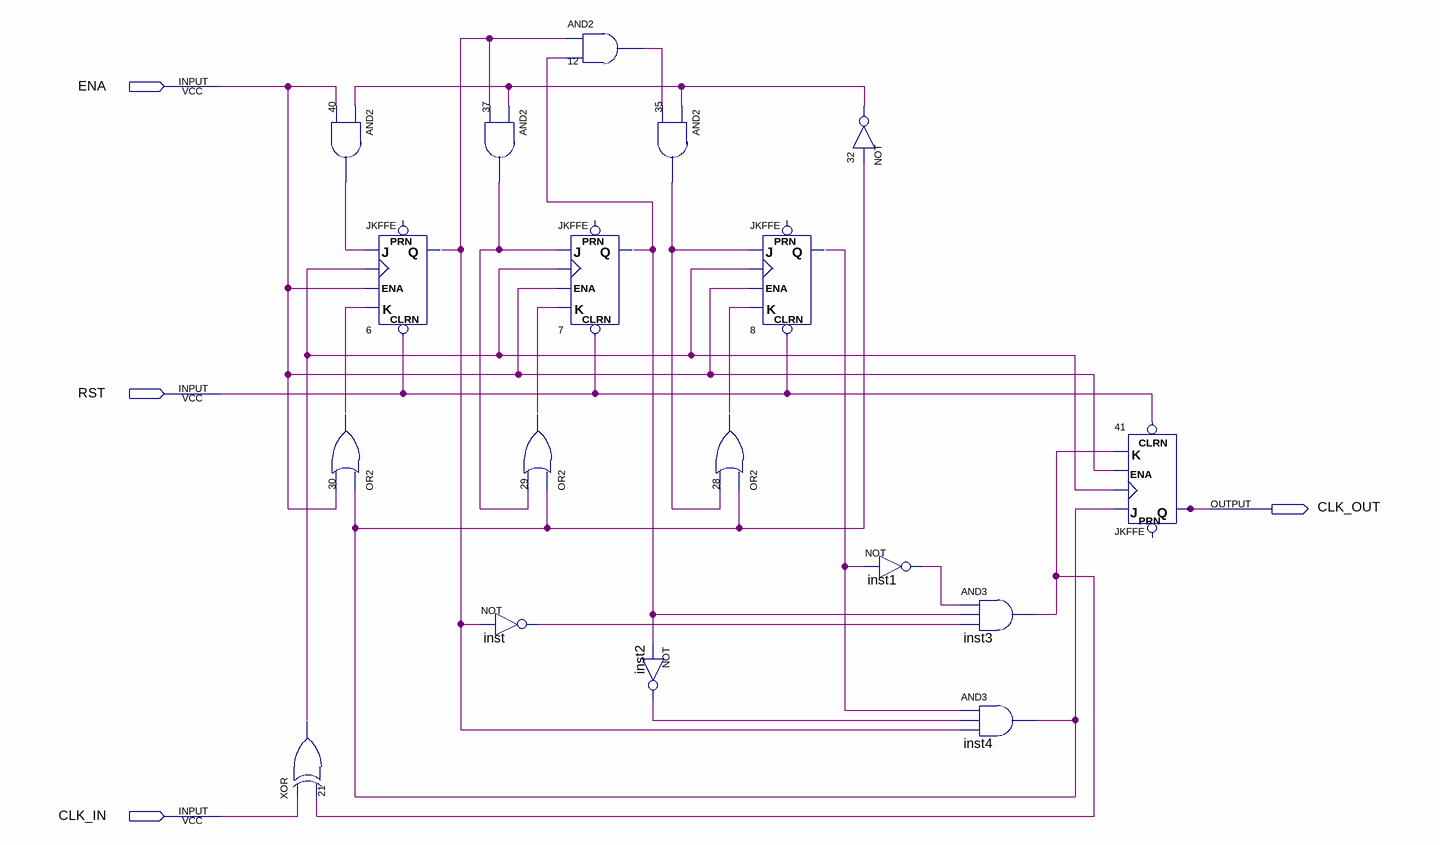
[diagram p0: schematic sheet]
// Quartus schematic div5.bdf as structural Verilog: 18 symbols, 4 pins
module div5 (
  input  ENA,
  input  RST,
  input  CLK_IN,
  output CLK_OUT
);

  wire inst1_out, inst2_out, inst3_out, inst4_out, inst_out, n6_q, n7_q, n8_q, n12_out, n21_out, n28_out,
       n29_out, n30_out, n32_out, n35_out, n37_out, n40_out;

  xor u_21 (n21_out, CLK_IN, inst3_out);
  and u_40 (n40_out, n32_out, ENA);
  JKFFE u_6 (.J(n40_out), .CLK(n21_out), .CLRN(RST), .K(n30_out), .ENA(ENA), .Q(n6_q));  // open: PRN
  or u_30 (n30_out, inst4_out, ENA);
  and u_37 (n37_out, n32_out, n6_q);
  or u_29 (n29_out, inst4_out, n37_out);
  not inst (inst_out, n6_q);
  and u_12 (n12_out, n6_q, n7_q);
  JKFFE u_7 (.J(n37_out), .CLK(n21_out), .CLRN(RST), .K(n29_out), .ENA(ENA), .Q(n7_q));  // open: PRN
  and u_35 (n35_out, n32_out, n12_out);
  not inst2 (inst2_out, n7_q);
  JKFFE u_8 (.J(n35_out), .CLK(n21_out), .CLRN(RST), .K(n28_out), .ENA(ENA), .Q(n8_q));  // open: PRN
  or u_28 (n28_out, inst4_out, n35_out);
  not u_32 (n32_out, inst4_out);
  not inst1 (inst1_out, n8_q);
  and inst3 (inst3_out, inst1_out, n7_q, inst_out);
  and inst4 (inst4_out, n8_q, inst2_out, n6_q);
  JKFFE u_41 (.J(inst4_out), .CLK(n21_out), .CLRN(RST), .K(inst3_out), .ENA(ENA), .Q(CLK_OUT));  // open: PRN
endmodule
